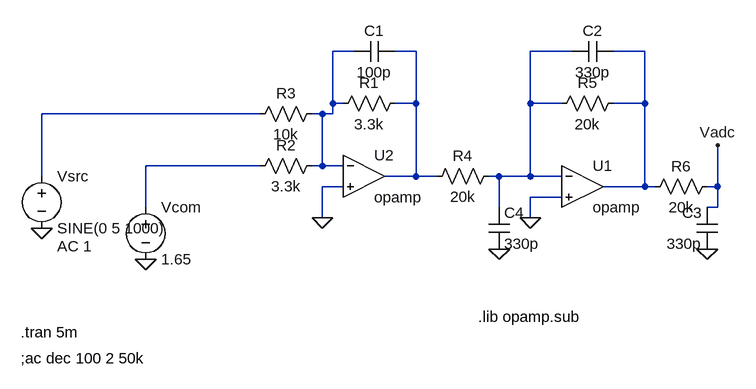
[diagram p0: schematic InputStage.asc]
InputStage.asc, the LTspice schematic file:
Version 4
SHEET 1 880 680
WIRE 64 -32 32 -32
WIRE 160 -32 128 -32
WIRE 400 -32 336 -32
WIRE 512 -32 464 -32
WIRE 32 48 32 -32
WIRE 48 48 32 48
WIRE 160 48 160 -32
WIRE 160 48 128 48
WIRE 336 48 336 -32
WIRE 384 48 336 48
WIRE 512 48 512 -32
WIRE 512 48 464 48
WIRE -80 64 -416 64
WIRE 16 64 0 64
WIRE 32 64 32 48
WIRE 32 64 16 64
WIRE -80 144 -256 144
WIRE 16 144 16 64
WIRE 16 144 0 144
WIRE 48 144 16 144
WIRE -416 160 -416 64
WIRE 160 160 160 48
WIRE 160 160 112 160
WIRE 192 160 160 160
WIRE 288 160 272 160
WIRE 336 160 336 48
WIRE 336 160 288 160
WIRE 384 160 336 160
WIRE 48 176 16 176
WIRE 512 176 512 48
WIRE 512 176 448 176
WIRE 528 176 512 176
WIRE 624 176 624 112
WIRE 624 176 608 176
WIRE 384 192 336 192
WIRE -256 208 -256 144
WIRE 288 208 288 160
WIRE 624 208 624 176
WIRE 624 208 608 208
WIRE 16 224 16 176
WIRE 336 224 336 192
FLAG -416 240 0
FLAG -256 288 0
FLAG 16 224 0
FLAG 336 224 0
FLAG 624 112 Vadc
FLAG 288 272 0
FLAG 608 272 0
SYMBOL Opamps\\opamp 416 112 R0
SYMATTR InstName U1
SYMBOL Opamps\\opamp 80 96 R0
SYMATTR InstName U2
SYMBOL voltage -256 192 R0
WINDOW 123 0 0 Left 2
WINDOW 39 0 0 Left 2
SYMATTR InstName Vcom
SYMATTR Value 1.65
SYMBOL voltage -416 144 R0
WINDOW 123 24 124 Left 2
WINDOW 39 0 0 Left 2
SYMATTR Value2 AC 1
SYMATTR InstName Vsrc
SYMATTR Value SINE(0 5 1000)
SYMBOL res 144 32 R90
WINDOW 0 0 56 VBottom 2
WINDOW 3 32 56 VTop 2
SYMATTR InstName R1
SYMATTR Value 3.3k
SYMBOL res 16 128 R90
WINDOW 0 0 56 VBottom 2
WINDOW 3 32 56 VTop 2
SYMATTR InstName R2
SYMATTR Value 3.3k
SYMBOL res 16 48 R90
WINDOW 0 0 56 VBottom 2
WINDOW 3 32 56 VTop 2
SYMATTR InstName R3
SYMATTR Value 10k
SYMBOL res 288 144 R90
WINDOW 0 0 56 VBottom 2
WINDOW 3 32 56 VTop 2
SYMATTR InstName R4
SYMATTR Value 20k
SYMBOL res 480 32 R90
WINDOW 0 0 56 VBottom 2
WINDOW 3 32 56 VTop 2
SYMATTR InstName R5
SYMATTR Value 20k
SYMBOL cap 128 -48 R90
WINDOW 0 0 32 VBottom 2
WINDOW 3 32 32 VTop 2
SYMATTR InstName C1
SYMATTR Value 100p
SYMBOL cap 464 -48 R90
WINDOW 0 0 32 VBottom 2
WINDOW 3 32 32 VTop 2
SYMATTR InstName C2
SYMATTR Value 330p
SYMBOL cap 624 272 R180
WINDOW 0 24 56 Left 2
WINDOW 3 24 8 Left 2
SYMATTR InstName C3
SYMATTR Value 330p
SYMBOL res 624 160 R90
WINDOW 0 0 56 VBottom 2
WINDOW 3 32 56 VTop 2
SYMATTR InstName R6
SYMATTR Value 20k
SYMBOL cap 272 208 R0
SYMATTR InstName C4
SYMATTR Value 330p
TEXT 256 376 Left 2 !.lib opamp.sub
TEXT -448 400 Left 2 !.tran 5m
TEXT -448 440 Left 2 !;ac dec 100 2 50k

The netlist it stands for:
* InputStage.asc
XU1 N003 0 N004 opamp Aol=100K GBW=10Meg  ; pins invin noninvin out
XU2 N001 0 N002 opamp Aol=100K GBW=10Meg  ; pins invin noninvin out
Vcom N006 0 1.65
Vsrc N005 0 SINE(0 5 1000) AC 1
R1 N002 N001 3.3k
R2 N001 N006 3.3k
R3 N001 N005 10k
R4 N003 N002 20k
R5 N004 N003 20k
C1 N002 N001 100p
C2 N004 N003 330p
C3 0 Vadc 330p
R6 Vadc N004 20k
C4 N003 0 330p
.lib opamp.sub
.tran 5m
;ac dec 100 2 50k
.backanno
.end